# EAGLE design V0p2_Main_PCB2 (EAGLE 7.1.0)
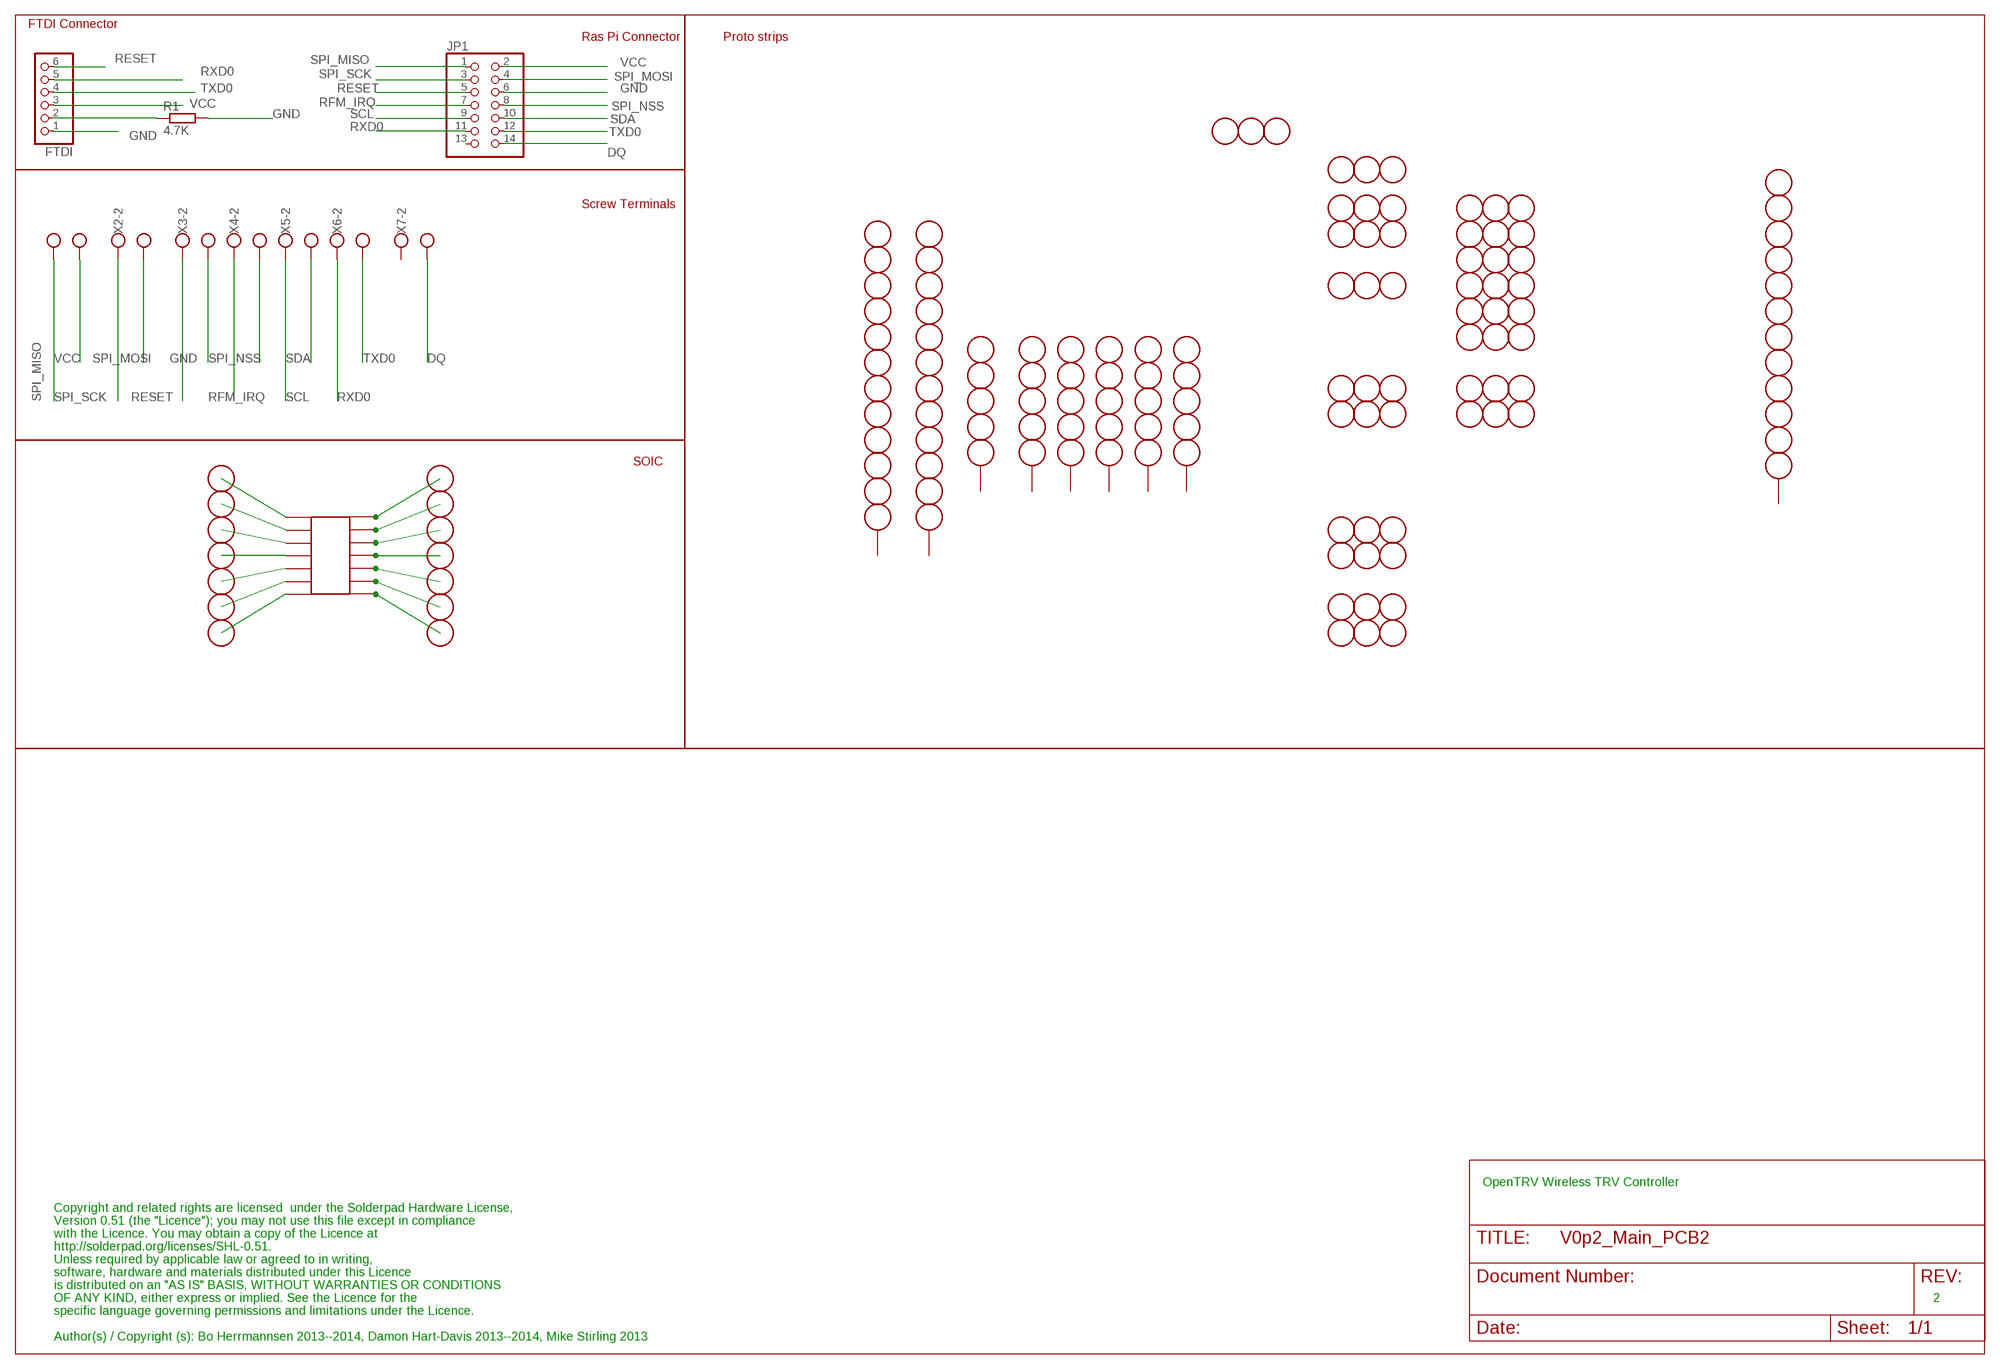
[diagram p0: schematic, sheet 1]

## Parts
FTDI  PINHD-1X6/90  [1X06/90]
GNDSTRIP1  12-STRIP  [12-STRIP]
GNDSTRIP4  12-STRIP  [12-STRIP]
IC1  SMD-14  [SO-14NMW]
JP1  PINHD-2X7  [2X07]
R1  4.7K  R-EU_R0603  [R0603]
U$1  5-STRIP  [5-STRIP]
U$2  PERF  [PERFHOLE]
U$4  5-STRIP  [5-STRIP]
U$5  3-STRIP  [3-STRIP]
U$6  PERF  [PERFHOLE]
U$7  5-STRIP  [5-STRIP]
U$8  PERF  [PERFHOLE]
U$9  PERF  [PERFHOLE]
U$10  3-STRIP  [3-STRIP]
U$11  3-STRIP  [3-STRIP]
U$12  3-STRIP  [3-STRIP]
U$13  3-STRIP  [3-STRIP]
U$14  3-STRIP  [3-STRIP]
U$15  3-STRIP  [3-STRIP]
U$16  5-STRIP  [5-STRIP]
U$17  3-STRIP  [3-STRIP]
U$18  3-STRIP  [3-STRIP]
U$19  PERF  [PERFHOLE]
U$24  5-STRIP  [5-STRIP]
U$25  PERF  [PERFHOLE]
U$26  3-STRIP  [3-STRIP]
U$27  PERF  [PERFHOLE]
U$30  3-STRIP  [3-STRIP]
U$32  3-STRIP  [3-STRIP]
U$33  3-STRIP  [3-STRIP]
U$34  PERF  [PERFHOLE]
U$35  PERF  [PERFHOLE]
U$36  5-STRIP  [5-STRIP]
U$37  PERF  [PERFHOLE]
U$38  PERF  [PERFHOLE]
U$39  PERF  [PERFHOLE]
U$40  PERF  [PERFHOLE]
U$41  PERF  [PERFHOLE]
U$43  3-STRIP  [3-STRIP]
U$44  3-STRIP  [3-STRIP]
U$45  3-STRIP  [3-STRIP]
U$46  3-STRIP  [3-STRIP]
U$47  3-STRIP  [3-STRIP]
U$48  3-STRIP  [3-STRIP]
VCCSTRIP2  12-STRIP  [12-STRIP]
X1  W237-102  [SCREWTERMINAL]
X2  W237-102  [SCREWTERMINAL]
X3  W237-102  [SCREWTERMINAL]
X4  W237-102  [SCREWTERMINAL]
X5  W237-102  [SCREWTERMINAL]
X6  W237-102  [SCREWTERMINAL]
X7  W237-102  [SCREWTERMINAL]

## Nets
DQ: JP1.14 X7.1
GND: FTDI.1 JP1.6 R1.2 X3.1
N$1: FTDI.2 R1.1
N$126: IC1.P$1 U$2.P$1
N$127: IC1.P$2 U$6.P$1
N$149: IC1.P$3 U$8.P$1
N$150: IC1.P$4 U$9.P$1
N$151: IC1.P$5 U$19.P$1
N$155: IC1.P$6 U$25.P$1
N$156: IC1.P$7 U$27.P$1
N$157: IC1.P$8 U$34.P$1
N$158: IC1.P$9 U$35.P$1
N$159: IC1.P$10 U$37.P$1
N$165: IC1.P$11 U$38.P$1
N$166: IC1.P$12 U$39.P$1
N$167: IC1.P$13 U$40.P$1
N$178: IC1.P$14 U$41.P$1
RESET: FTDI.6 X3.2
RFM_IRQ: JP1.7 X4.2
RXD0: FTDI.5 X6.2
SCL: JP1.9 X5.2
SDA: JP1.10 X5.1
SPI_MISO: JP1.1 X1.2
SPI_MOSI: JP1.4 X2.1
SPI_NSS: JP1.8 X4.1
SPI_SCK: JP1.3 X2.2
TXD0: FTDI.4 X6.1
VCC: FTDI.3 JP1.2 X1.1
Unconnected: GNDSTRIP1.P$1 GNDSTRIP4.P$1 JP1.5 JP1.11 JP1.12 JP1.13 U$1.P$3 U$4.P$3 U$7.P$3 U$16.P$3 U$24.P$3 U$36.P$3 VCCSTRIP2.P$1 X7.2

## Notes on the sheet
- FTDI Connector
- Ras Pi Connector | Proto strips
- DQ
- Screw Terminals
- SOIC
- OpenTRV Wireless TRV Controller
- Copyright and related rights are licensed  under the Solderpad Hardware License,
- Version 0.51 (the "Licence"); you may not use this file except in compliance
- with the Licence. You may obtain a copy of the Licence at
- http://solderpad.org/licenses/SHL-0.51.
- Unless required by applicable law or agreed to in writing,
- software, hardware and materials distributed under this Licence
- is distributed on an "AS IS" BASIS, WITHOUT WARRANTIES OR CONDITIONS
- OF ANY KIND, either express or implied. See the Licence for the | 2
- specific language governing permissions and limitations under the Licence.
- Author(s) / Copyright (s): Bo Herrmannsen 2013--2014, Damon Hart-Davis 2013--2014, Mike Stirling 2013

## Library data of the parts
FTDI = pinhead:PINHD-1X6: PIN HEADER
GNDSTRIP1 GNDSTRIP4 VCCSTRIP2 = Atmex:12-STRIP
IC1 = carduino:SMD-14
JP1 = pinhead:PINHD-2X7: PIN HEADER
R1 = rcl:R-EU_: RESISTOR, European symbol
U$1 U$4 U$7 U$16 U$24 U$36 = Atmex:5-STRIP
U$2 U$6 U$8 U$9 U$19 U$25 U$27 U$34 U$35 U$37-U$41 = carduino:PERF
U$5 U$10-U$15 U$17 U$18 U$26 U$30 U$32 U$33 U$43-U$48 = Atmex:3-STRIP
X1-X7 = screwterminal:W237-102: Screw terminal 3.5mm Pitch RS No: 710-0444 MRF No:1776275-2; MPN: 237-102; OC_FARNELL: unknown; OC_NEWARK: 70K9898

## Net classes
0 default: width 0.203 mm
1 supply: width 0.5 mm, clearance 0.203 mm

## Board
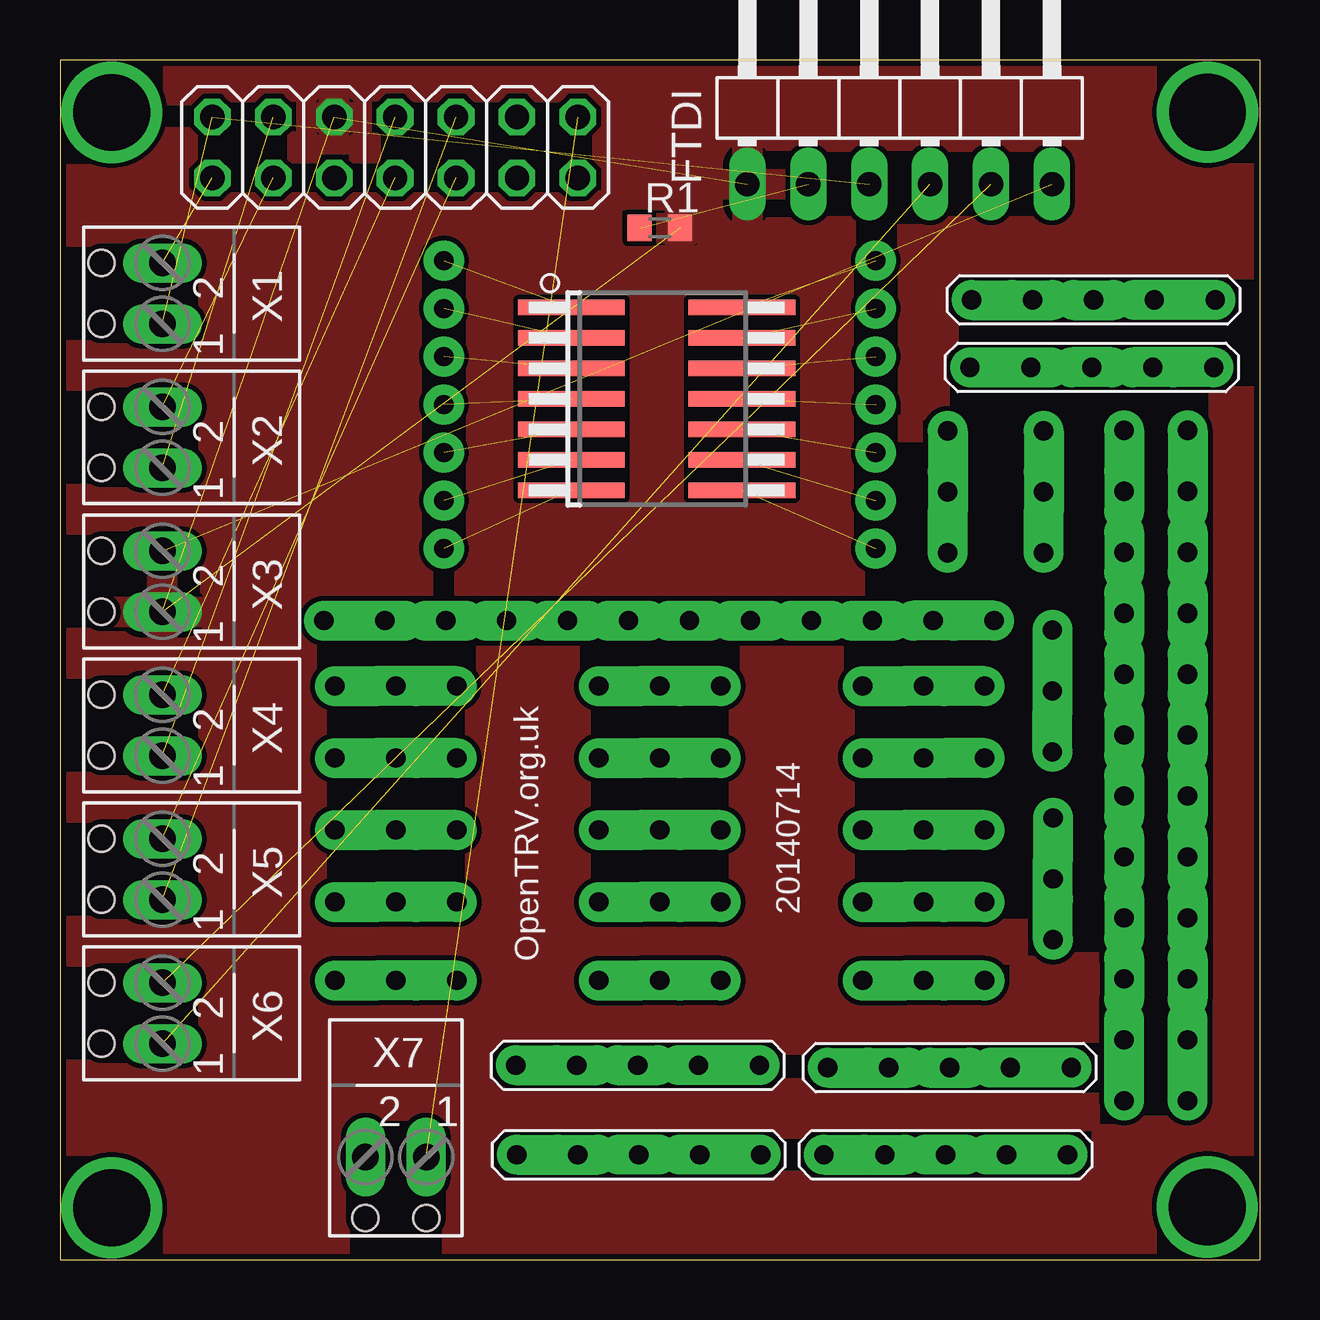
[diagram p1: board, top side]
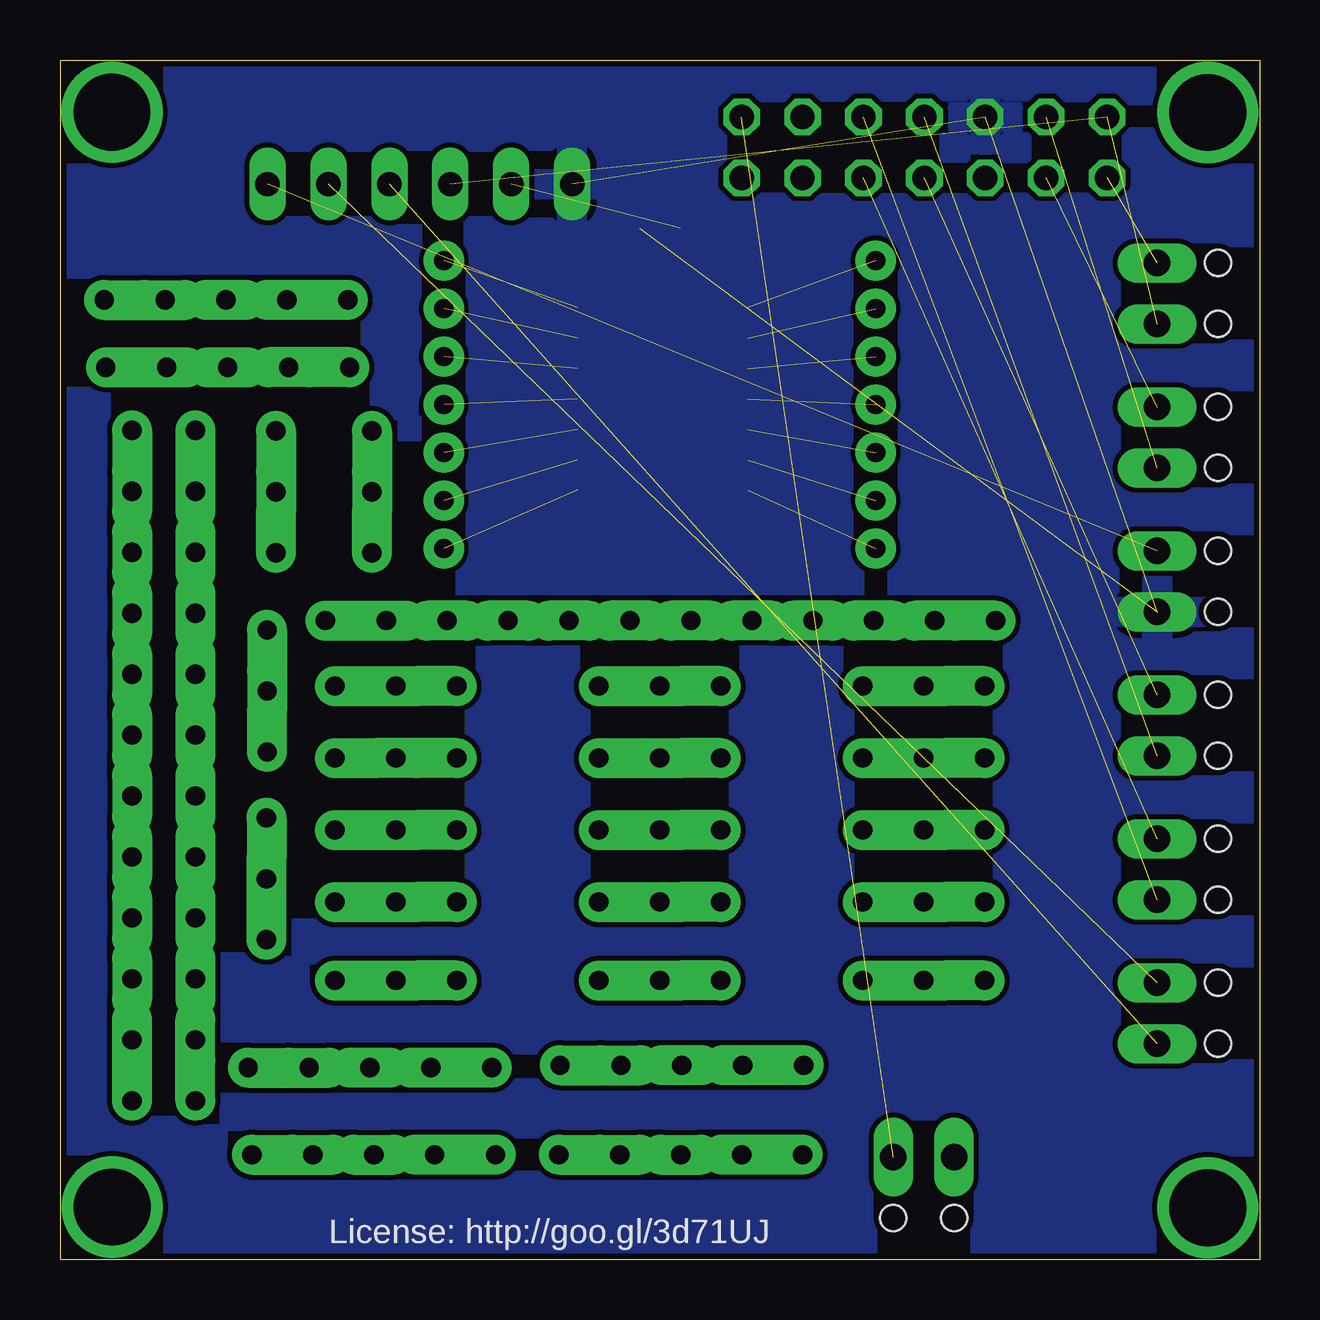
[diagram p2: board, bottom side, seen from below]

Size 50 x 50 mm. Coordinates in mm from the lower left corner, seen from the top.
Outline: 0,0 50,0 50,50 0,50 0,0
Copper layers (1*16): Top 0.035mm / dielectric 1.5mm / Bottom 0.035mm
Design rules "PMServicesStd": minimum track width 8mil, minimum drill 12mil, track to track 8mil, track to pad 8mil, pad to pad 8mil, via to via 8mil, smd to smd 0mil, copper to edge 10mil, drill to drill 10mil, minimum pad ring 10mil, minimum via ring 6mil, stop-mask expansion 2mil, vias tented up to drill 100mil, thermal gap 10mil

### Footprints (pad centres in the part's own frame; a part is rotated, then mirrored left to right if it is on the bottom)
1X06/90 = drill 1.016 long: 1 -6.35,-3.81; 2 -3.81,-3.81; 3 -1.27,-3.81; 4 1.27,-3.81; 5 3.81,-3.81; 6 6.35,-3.81
12-STRIP = drill 0.8 pad 1.676 offset: P$1 0,0; P$11 27.94,0 | drill 0.8 pad 1.676 long: P$2 2.54,0; P$3 5.08,0; P$4 7.62,0; P$5 10.16,0; P$6 12.7,0; P$7 15.24,0; P$8 17.78,0; P$9 20.32,0; P$10 22.86,0; P$12 25.4,0
SO-14NMW = smd 0.635 x 4.445: P$1 -3.048,-3.683; P$2 -1.778,-3.683; P$3 -0.508,-3.683; P$4 0.762,-3.683; P$5 2.032,-3.683; P$6 3.302,-3.683; P$7 4.572,-3.683; P$8 4.572,3.429; P$9 3.302,3.429; P$10 2.032,3.429; P$11 0.762,3.429; P$12 -0.508,3.429; P$13 -1.778,3.429; P$14 -3.048,3.429
2X07 = drill 1.016 octagon: 1 -7.62,-1.27; 2 -7.62,1.27; 3 -5.08,-1.27; 4 -5.08,1.27; 5 -2.54,-1.27; 6 -2.54,1.27; 7 0,-1.27; 8 0,1.27; 9 2.54,-1.27; 10 2.54,1.27; 11 5.08,-1.27; 12 5.08,1.27; 13 7.62,-1.27; 14 7.62,1.27
R0603 = smd 1 x 1.1: 1 -0.85,0; 2 0.85,0
5-STRIP = drill 0.8 pad 1.676 long: P$1 2.54,0; P$2 5.08,0; P$5 7.62,0 | drill 0.8 pad 1.676 offset: P$3 0,0; P$4 10.16,0
PERFHOLE = drill 0.8 pad 1.676: P$1 0,0
3-STRIP = drill 0.8 pad 1.676 offset: 1 -2.54,0; P$5 2.54,0 | drill 0.8 pad 1.676 long: P$6 0,0
SCREWTERMINAL = drill 1.1 long: 1 -1.27,-1.27; 2 1.27,-1.27 | hole 1.1: -1.27,1.27; 1.27,1.27

### Placement (x,y rotation side)
FTDI  35,48.63 0 top
GNDSTRIP1  11,26.64 0 top
GNDSTRIP4  44.35,34.56 270 top
IC1  25,36.63 270 top
JP1  13.97,46.35 0 top
R1  25,43 0 top
U$1  38,40 0 top
U$2  16,41.63 0 top
U$4  32,8 0 top
U$5  41.37,23.7 90 top
U$6  16,39.63 0 top
U$7  42,4.37 180 top
U$8  16,37.63 0 top
U$9  16,35.63 0 top
U$10  37,32 90 top
U$11  14,20.91 0 top
U$12  25,20.91 0 top
U$13  25,17.91 0 top
U$14  36,17.91 0 top
U$15  41,32 90 top
U$16  48.09,37.19 180 top
U$17  41.4,15.87 270 top
U$18  14,17.91 0 top
U$19  16,33.63 0 top
U$24  29.2,4.37 180 top
U$25  16,31.64 0 top
U$26  14,23.91 0 top
U$27  16,29.64 0 top
U$30  25,23.91 0 top
U$32  36,23.91 0 top
U$33  36,20.91 180 top
U$34  34,29.64 0 top
U$35  34,31.64 0 top
U$36  19,8.1 0 top
U$37  34,33.63 0 top
U$38  34,35.63 0 top
U$39  34,37.63 0 top
U$40  34,39.63 0 top
U$41  34,41.63 0 top
U$43  14,14.9 0 top
U$44  25,14.9 0 top
U$45  36,14.9 0 top
U$46  14,11.63 0 top
U$47  25,11.63 0 top
U$48  36,11.63 0 top
VCCSTRIP2  47,34.56 270 top
X1  3,40.27 90 top
X2  3,34.27 90 top
X3  3,28.27 90 top
X4  3,22.27 90 top
X5  3,16.27 90 top
X6  3,10.27 90 top
X7  14,3 180 top

### Tracks (layer width: path | path; a pad name or v marks a point on that pad's centre or on a via)
DQ  (1 unrouted)
GND  (3 unrouted)
  pour Bottom: 0,0 50,0 50,50 0,50
  pour Top: 0,50 0,0 50,0 50,50
N$1  (1 unrouted)
N$4  (via drill 3.2)
  other vias: 2.16,47.81
N$12  (via drill 3.2)
  other vias: 47.83,2.19
N$19  (via drill 3.2)
  other vias: 47.83,47.82
N$22  (via drill 3.2)
  other vias: 2.16,2.16
N$126  (1 unrouted)
N$127  (1 unrouted)
N$149  (1 unrouted)
N$150  (1 unrouted)
N$151  (1 unrouted)
N$155  (1 unrouted)
N$156  (1 unrouted)
N$157  (1 unrouted)
N$158  (1 unrouted)
N$159  (1 unrouted)
N$165  (1 unrouted)
N$166  (1 unrouted)
N$167  (1 unrouted)
N$178  (1 unrouted)
RESET  (1 unrouted)
RFM_IRQ  (1 unrouted)
RXD0  (1 unrouted)
SCL  (1 unrouted)
SDA  (1 unrouted)
SPI_MISO  (1 unrouted)
SPI_MOSI  (1 unrouted)
SPI_NSS  (1 unrouted)
SPI_SCK  (1 unrouted)
TXD0  (1 unrouted)
VCC  (2 unrouted)

### Text on the board
bPlace: License: http://goo.gl/3d71UJ
tNames: 20140714 | OpenTRV.org.uk